# EAGLE design esp8266_analog_read (EAGLE 8.3.1)
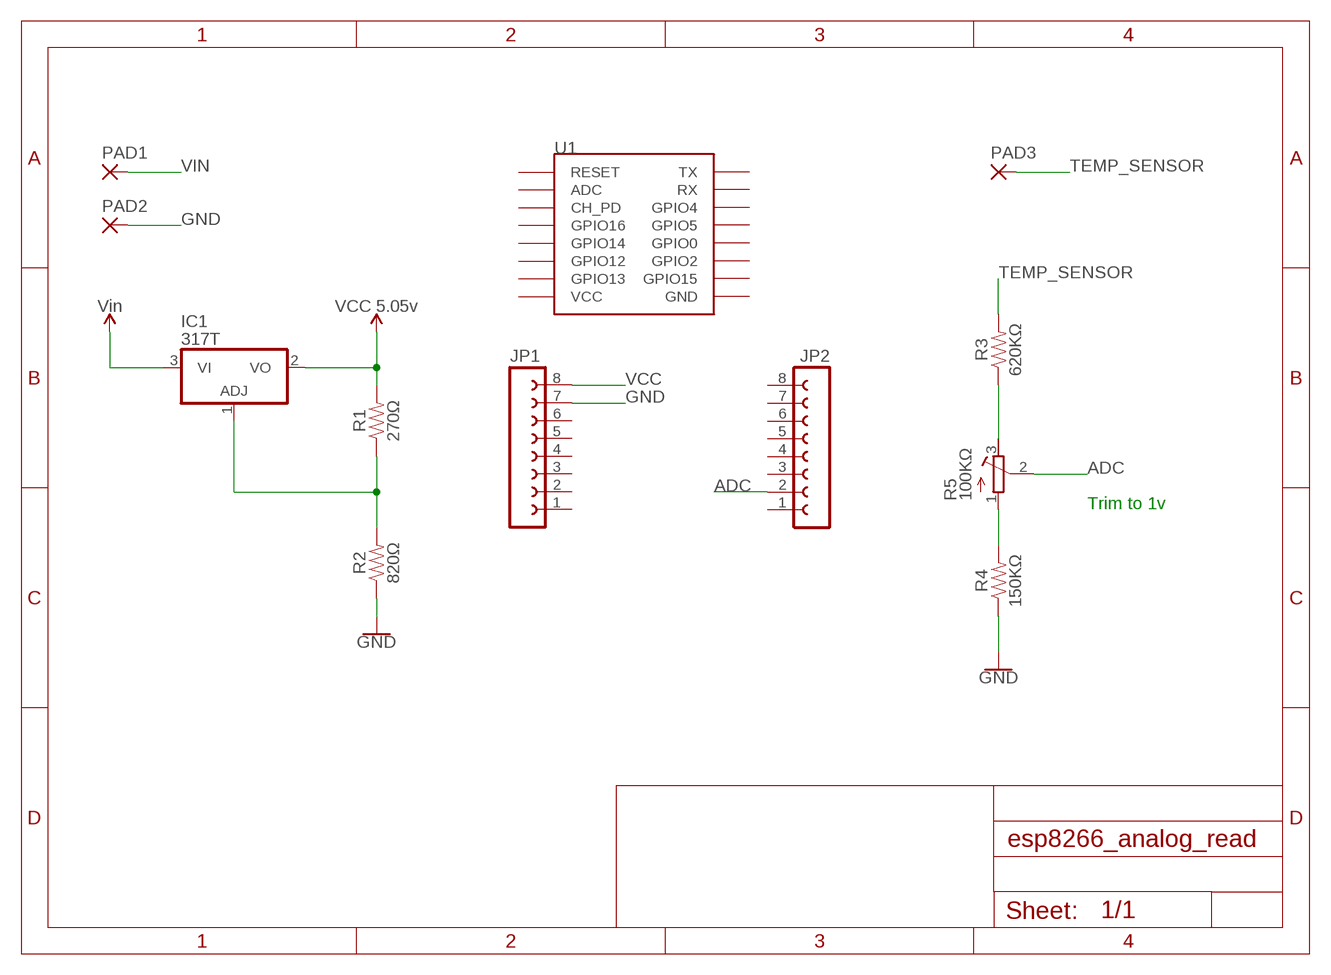
[diagram p0: schematic, sheet 1]

## Parts
IC1  317T  [TO220H]
JP1  FE08-1  [FE08]
JP2  FE08-1  [FE08]
PAD1  2,54/1,0  [2,54/1,0]
PAD2  2,54/1,0  [2,54/1,0]
PAD3  2,54/1,0  [2,54/1,0]
R1  270Ω  RESISTORAXIAL-0.3  [AXIAL-0.3]
R2  820Ω  RESISTORAXIAL-0.3  [AXIAL-0.3]
R3  620KΩ  RESISTORAXIAL-0.3  [AXIAL-0.3]
R4  150KΩ  RESISTORAXIAL-0.3  [AXIAL-0.3]
R5  100KΩ  R-TRIMM3339P  [RTRIM3339P]
U1  ESP12  [ESP12]

## Nets
ADC: JP2.2 R5.2(S)
GND: JP1.7 PAD2.1(P) R2.P$1 R4.P$1
N$1: R3.P$1 R5.3(E)
N$2: R4.P$2 R5.1(A)
N$3: IC1.1(ADJ) R1.P$1 R2.P$2
TEMP_SENSOR: PAD3.1(P) R3.P$2
VCC: IC1.2(VO) JP1.8 R1.P$2 ; supply symbol labelled VCC 5.05v
VIN: IC1.3(VI) PAD1.1(P) ; supply symbol labelled Vin
Unconnected: JP1.1 JP1.2 JP1.3 JP1.4 JP1.5 JP1.6 JP2.1 JP2.3 JP2.4 JP2.5 JP2.6 JP2.7 JP2.8 U1.ADC U1.CH_PD U1.GND U1.GPIO0 U1.GPIO2 U1.GPIO4 U1.GPIO5 U1.GPIO12 U1.GPIO13 U1.GPIO14 U1.GPIO15 U1.GPIO16 U1.RESET U1.RX U1.TX U1.VCC

## Notes on the sheet
- Trim to 1v

## Library data of the parts
IC1 = linear:*317: Positive VOLTAGE REGULATOR
JP1 JP2 = con-lsta:FE08-1: FEMALE HEADER; OC_FARNELL: unknown; OC_NEWARK: unknown
PAD1-PAD3 = wirepad:2,54/1,0: THROUGH-HOLE PAD
R1-R4 = SparkFun-Resistors:RESISTOR: Generic Resistor Package
R5 = resistor:R-TRIMM: Trimm resistor
U1 = esp8266modules:ESP12: ESP8266 Wifi module 12

## Board
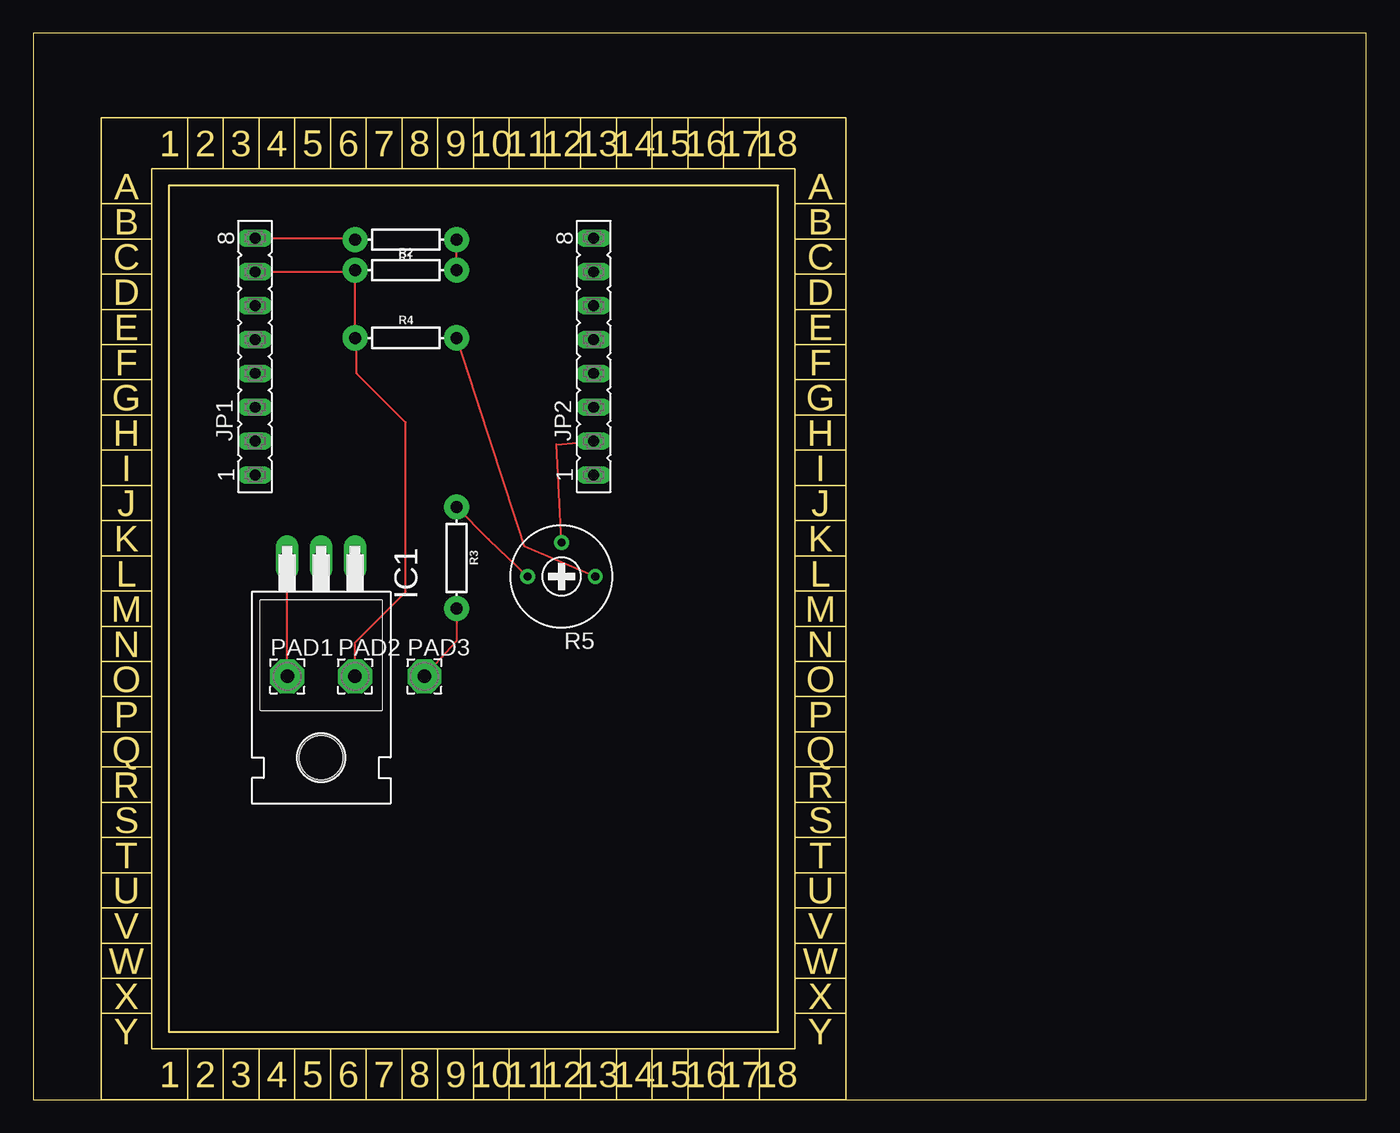
[diagram p1: board, top side]
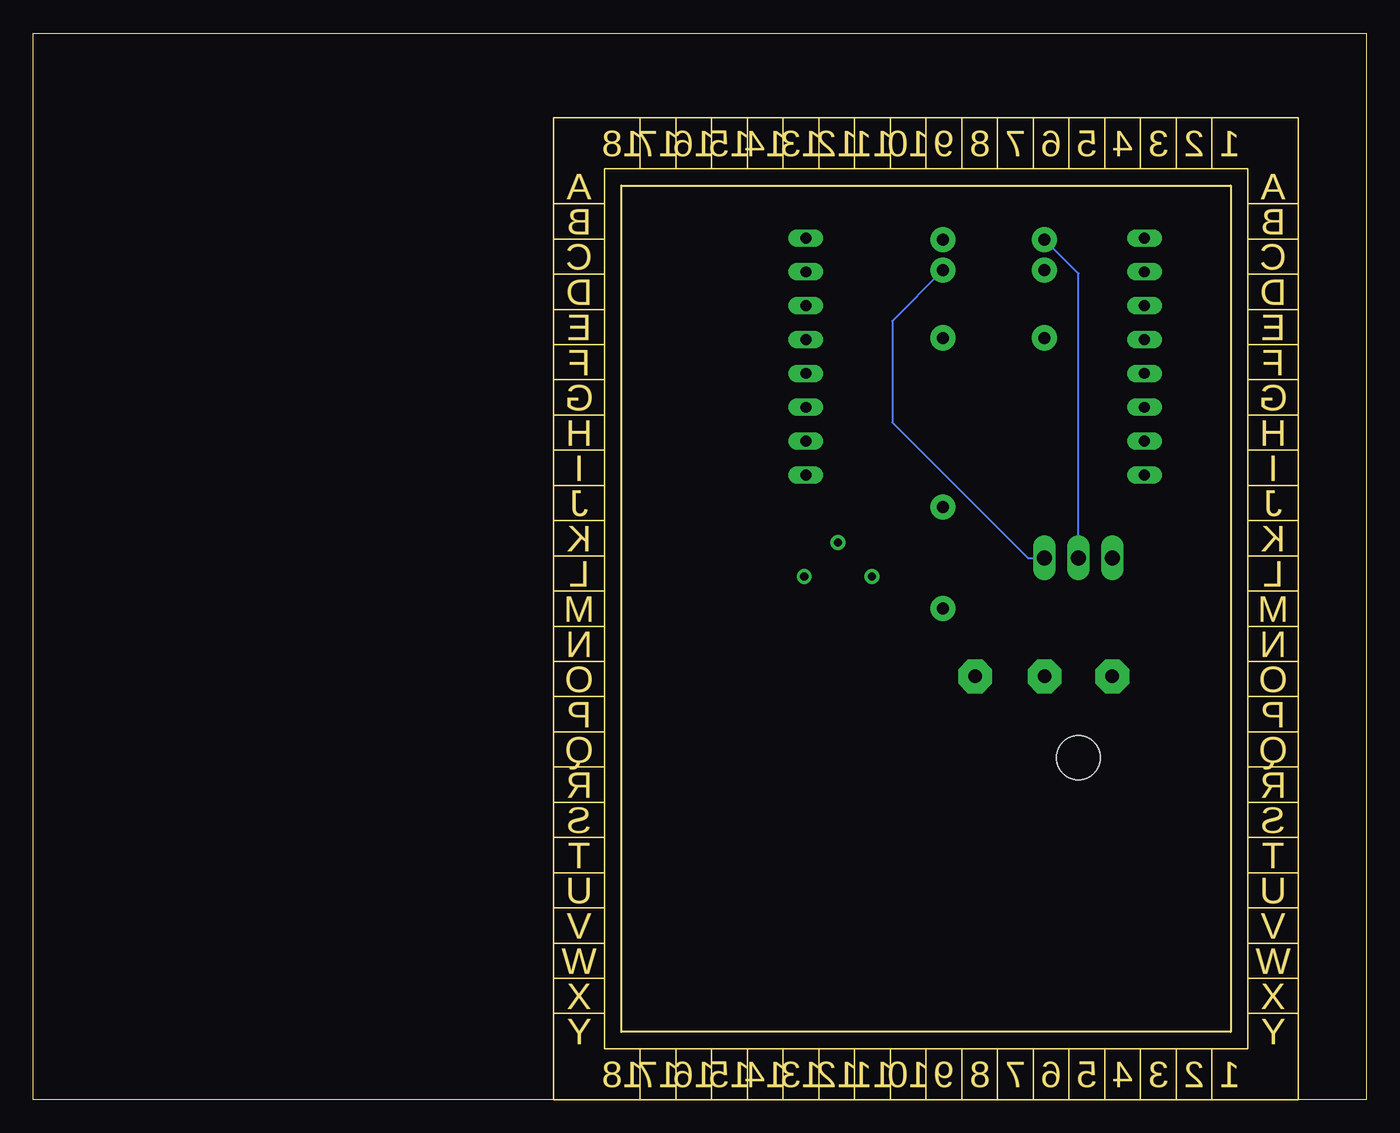
[diagram p2: board, bottom side, seen from below]

Size 100 x 80 mm. Coordinates in mm from the lower left corner, seen from the top.
Outline: 0,0 100,0 100,80 0,80 0,0
Outline: 10.16,5.08 55.88,5.08 55.88,68.58 10.16,68.58 10.16,5.08
Copper layers (1*16): Top 0.035mm / dielectric 1.5mm / Bottom 0.035mm
Design rules "default": minimum track width 6mil, minimum drill 0.35mm, track to track 6mil, track to pad 6mil, pad to pad 6mil, via to via 6mil, smd to smd 6mil, copper to edge 40mil, drill to drill 6mil, minimum pad ring 10mil, minimum via ring 8mil, stop-mask expansion 4mil, vias tented up to drill 0mil, thermal gap 10mil

### Footprints (pad centres in the part's own frame; a part is rotated, then mirrored left to right if it is on the bottom)
TO220H = drill 1.118 long: 1 -2.54,-10.16; 2 0,-10.16; 3 2.54,-10.16 | hole 3.302: 0,4.826
FE08 = drill 0.813 long: 1 -8.89,0; 2 -6.35,0; 3 -3.81,0; 4 -1.27,0; 5 1.27,0; 6 3.81,0; 7 6.35,0; 8 8.89,0
2,54/1,0 = drill 1.016 pad 2.54 octagon: 1 0,0
AXIAL-0.3 = drill 0.9 pad 1.88: P$1 -3.81,0; P$2 3.81,0
RTRIM3339P = drill 0.61: 1 -2.54,0; 2 0,-2.54; 3 2.54,0
ESP12 = drill 0.7 offset: ADC -7.1,3.8; CH_PD -7.1,1.8; GND 6.9,-8.2; GPIO0 6.9,-2.2; GPIO2 6.9,-4.2; GPIO4 6.9,1.8; GPIO5 6.9,-0.2; GPIO12 -7.1,-4.2; GPIO13 -7.1,-6.2; GPIO14 -7.1,-2.2; GPIO15 6.9,-6.2; GPIO16 -7.1,-0.2; RESET -7.1,5.8; RX 6.9,3.8; TX 6.9,5.8; VCC -7.1,-8.2

### Placement (x,y rotation side)
IC1  21.59,30.48 180 top
JP1  16.64,55.75 90 top
JP2  42.04,55.75 90 top
PAD1  19.05,31.75 0 top
PAD2  24.13,31.75 0 top
PAD3  29.34,31.75 0 top
R1  27.94,64.52 180 top
R2  27.94,62.23 0 top
R3  31.75,40.64 270 top
R4  27.94,57.15 0 top
R5  39.62,39.24 180 top
U1  -22.86,10.16 0 top  (outside the outline)

### Tracks (layer width: path | path; a pad name or v marks a point on that pad's centre or on a via)
ADC
  Top 0.152: R5.2 39.24,49.15 JP2.2
GND
  Top 0.152: JP1.7 24,62.1 R2.P$1 R4.P$1 24.26,57.02 24.26,54.48 27.94,50.8 27.94,38.1 24.13,34.29 PAD2.1
N$1
  Top 0.152: R5.3 34.16,42.04 R3.P$1
N$2
  Top 0.152: R4.P$2 36.83,41.53 R5.1
N$3
  Top 0.152: R2.P$2 R1.P$1
  Bottom 0.152: R2.P$2 35.56,58.42 35.56,50.8 25.4,40.64 IC1.1
TEMP_SENSOR
  Top 0.152: R3.P$2 31.75,34.42 PAD3.1
VCC
  Top 0.152: JP1.8 24,64.64 R1.P$2
  Bottom 0.152: IC1.2 21.59,61.98 R1.P$2
VIN
  Top 0.152: PAD1.1 IC1.3